# Altium schematic sheet relays_1-4.SchDoc
size B
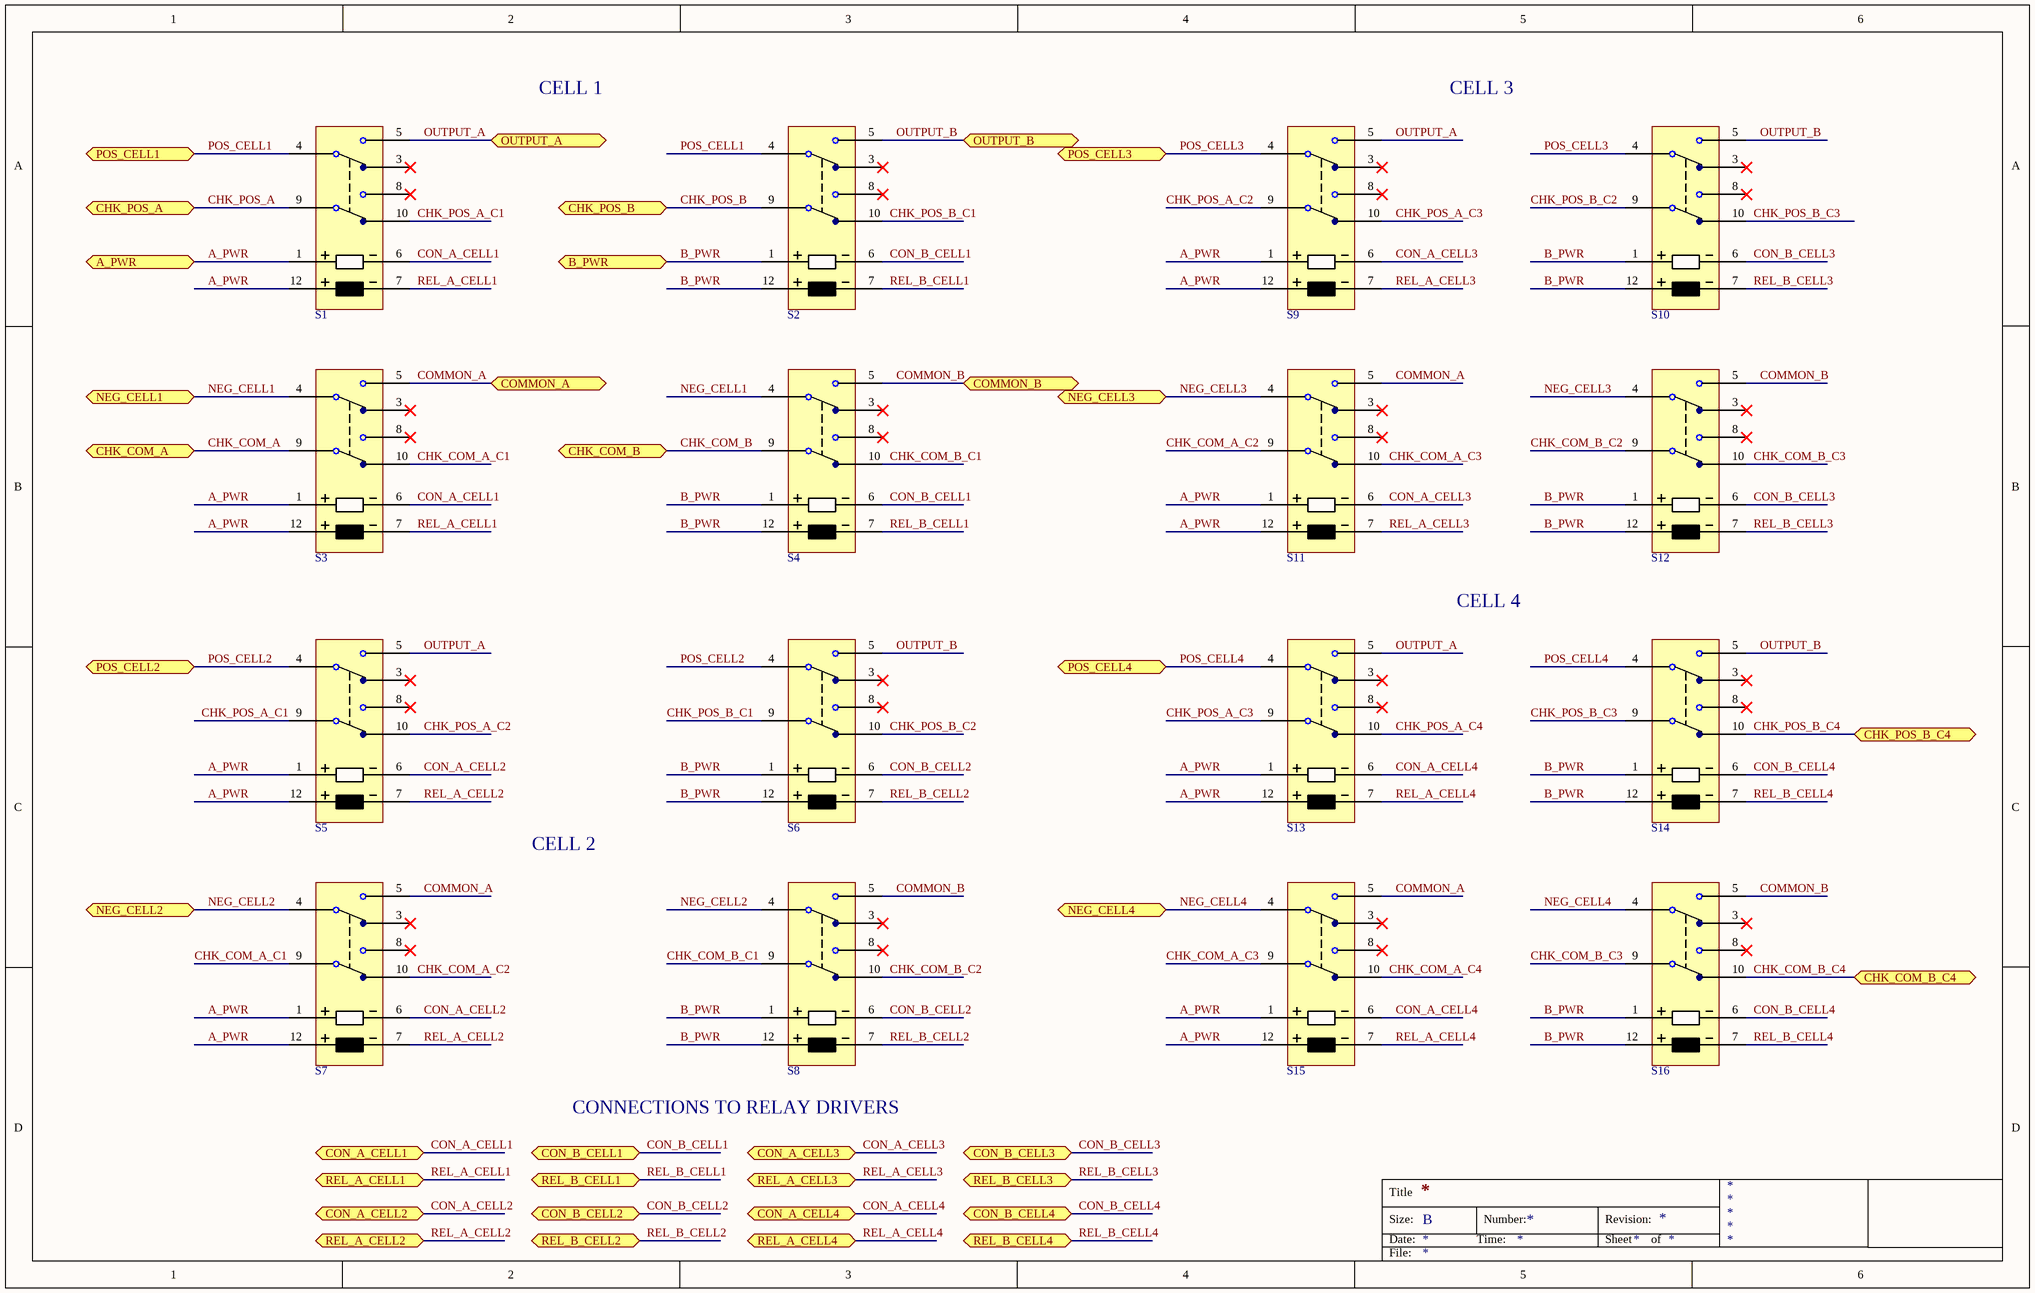
[diagram p0: relays_1-4.SchDoc]

## Parts
S1  DPDT_RELAY_L2  [L2_RELAY]  (value not drawn)
S2  DPDT_RELAY_L2  [L2_RELAY]  (value not drawn)
S3  DPDT_RELAY_L2  [L2_RELAY]  (value not drawn)
S4  DPDT_RELAY_L2  [L2_RELAY]  (value not drawn)
S5  DPDT_RELAY_L2  [L2_RELAY]  (value not drawn)
S6  DPDT_RELAY_L2  [L2_RELAY]  (value not drawn)
S7  DPDT_RELAY_L2  [L2_RELAY]  (value not drawn)
S8  DPDT_RELAY_L2  [L2_RELAY]  (value not drawn)
S9  DPDT_RELAY_L2  [L2_RELAY]  (value not drawn)
S10  DPDT_RELAY_L2  [L2_RELAY]  (value not drawn)
S11  DPDT_RELAY_L2  [L2_RELAY]  (value not drawn)
S12  DPDT_RELAY_L2  [L2_RELAY]  (value not drawn)
S13  DPDT_RELAY_L2  [L2_RELAY]  (value not drawn)
S14  DPDT_RELAY_L2  [L2_RELAY]  (value not drawn)
S15  DPDT_RELAY_L2  [L2_RELAY]  (value not drawn)
S16  DPDT_RELAY_L2  [L2_RELAY]  (value not drawn)

## Ports
A_PWR, B_PWR, CHK_COM_A, CHK_COM_B, CHK_COM_B_C4, CHK_POS_A, CHK_POS_B, CHK_POS_B_C4, COMMON_A, COMMON_B, CON_A_CELL1, CON_A_CELL2, CON_A_CELL3, CON_A_CELL4, CON_B_CELL1, CON_B_CELL2, CON_B_CELL3, CON_B_CELL4, NEG_CELL1, NEG_CELL2, NEG_CELL3, NEG_CELL4, OUTPUT_A, OUTPUT_B, POS_CELL1, POS_CELL2, POS_CELL3, POS_CELL4, REL_A_CELL1, REL_A_CELL2, REL_A_CELL3, REL_A_CELL4, REL_B_CELL1, REL_B_CELL2, REL_B_CELL3, REL_B_CELL4

## Nets
A_PWR: S1.1 S1.12 S3.1 S3.12 S5.1 S5.12 S7.1 S7.12 S9.1 S9.12 S11.1 S11.12 S13.1 S13.12 S15.1 S15.12 ; port A_PWR
B_PWR: S2.1 S2.12 S4.1 S4.12 S6.1 S6.12 S8.1 S8.12 S10.1 S10.12 S12.1 S12.12 S14.1 S14.12 S16.1 S16.12 ; port B_PWR
CHK_COM_A: S3.9 ; port CHK_COM_A
CHK_COM_A_C1: S3.10 S7.9
CHK_COM_A_C2: S7.10 S11.9
CHK_COM_A_C3: S11.10 S15.9
CHK_COM_A_C4: S15.10
CHK_COM_B: S4.9 ; port CHK_COM_B
CHK_COM_B_C1: S4.10 S8.9
CHK_COM_B_C2: S8.10 S12.9
CHK_COM_B_C3: S12.10 S16.9
CHK_COM_B_C4: S16.10 ; port CHK_COM_B_C4
CHK_POS_A: S1.9 ; port CHK_POS_A
CHK_POS_A_C1: S1.10 S5.9
CHK_POS_A_C2: S5.10 S9.9
CHK_POS_A_C3: S9.10 S13.9
CHK_POS_A_C4: S13.10
CHK_POS_B: S2.9 ; port CHK_POS_B
CHK_POS_B_C1: S2.10 S6.9
CHK_POS_B_C2: S6.10 S10.9
CHK_POS_B_C3: S10.10 S14.9
CHK_POS_B_C4: S14.10 ; port CHK_POS_B_C4
COMMON_A: S3.5 S7.5 S11.5 S15.5 ; port COMMON_A
COMMON_B: S4.5 S8.5 S12.5 S16.5 ; port COMMON_B
CON_A_CELL1: S1.6 S3.6 ; port CON_A_CELL1
CON_A_CELL2: S5.6 S7.6 ; port CON_A_CELL2
CON_A_CELL3: S9.6 S11.6 ; port CON_A_CELL3
CON_A_CELL4: S13.6 S15.6 ; port CON_A_CELL4
CON_B_CELL1: S2.6 S4.6 ; port CON_B_CELL1
CON_B_CELL2: S6.6 S8.6 ; port CON_B_CELL2
CON_B_CELL3: S10.6 S12.6 ; port CON_B_CELL3
CON_B_CELL4: S14.6 S16.6 ; port CON_B_CELL4
NEG_CELL1: S3.4 S4.4 ; port NEG_CELL1
NEG_CELL2: S7.4 S8.4 ; port NEG_CELL2
NEG_CELL3: S11.4 S12.4 ; port NEG_CELL3
NEG_CELL4: S15.4 S16.4 ; port NEG_CELL4
OUTPUT_A: S1.5 S5.5 S9.5 S13.5 ; port OUTPUT_A
OUTPUT_B: S2.5 S6.5 S10.5 S14.5 ; port OUTPUT_B
POS_CELL1: S1.4 S2.4 ; port POS_CELL1
POS_CELL2: S5.4 S6.4 ; port POS_CELL2
POS_CELL3: S9.4 S10.4 ; port POS_CELL3
POS_CELL4: S13.4 S14.4 ; port POS_CELL4
REL_A_CELL1: S1.7 S3.7 ; port REL_A_CELL1
REL_A_CELL2: S5.7 S7.7 ; port REL_A_CELL2
REL_A_CELL3: S9.7 S11.7 ; port REL_A_CELL3
REL_A_CELL4: S13.7 S15.7 ; port REL_A_CELL4
REL_B_CELL1: S2.7 S4.7 ; port REL_B_CELL1
REL_B_CELL2: S6.7 S8.7 ; port REL_B_CELL2
REL_B_CELL3: S10.7 S12.7 ; port REL_B_CELL3
REL_B_CELL4: S14.7 S16.7 ; port REL_B_CELL4

Not connected (* = marked no-connect by the designer): S1 3* 8*; S2 3* 8*; S3 3* 8*; S4 3* 8*; S5 3* 8*; S6 3* 8*; S7 3* 8*; S8 3* 8*; S9 3* 8*; S10 3* 8*; S11 3* 8*; S12 3* 8*; S13 3* 8*; S14 3* 8*; S15 3* 8*; S16 3* 8*

## Notes on the sheet
- CELL 1
- CELL 3
- CELL 4
- CELL 2
- (near S8) CONNECTIONS TO RELAY DRIVERS
- Title
- Size:
- Date:
- B
- Time:
- Number:
- Revision:
- Sheet
- of
- File:

## Library data of the parts
S1-S16 = TXS2-L2-4.5V: RELAY GEN PURPOSE DPDT 1A 4.5V; Manufacturer: Panasonic Electric Works; Relay Type: General Purpose; Coil Type: Latching, Dual Coil; Coil Voltage: 4.5VDC; Contact Form: DPDT (2 Form C); Switching Voltage: 110VDC - Max; Turn On Voltage (Max): 3.6 VDC; Coil Power: 70 mW; Design Item Id: TXS2-L2-4.5V; Supplier 1: Digi-Key; Supplier Part Number 1: 255-2340-5-ND; Manufacturer Part Number: TXS2-L2-4.5V; RoHS: RoHS Compliant; Category: Relays; Stock 1: 1242; Pricing 1: 1=5.28, 10=4.95, 25=4.4, 50=4.18, 100=3.96, 250=3.52, 500=3.3, 1000=3.08 (USD); Packaging: Tube; Features: Sealed - Fully; Operating Temperature: -40°C ~ 70°C; Mounting Type: Through Hole; ComponentLink1URL: http://www.panasonic-electric-works.com/eu-asset/en/downloads/ds_61022_en_txs.pdf; ComponentLink1Description: http://www.panasonic-electric-works.com/eu-asset/en/downloads/ds_61022_en_txs.pdf; Termination Style: PC Pin; Part Status: Active; Turn Off Voltage (Min): -; Contact Material: Silver (Ag), Gold (Au)